# Altium schematic sheet usb_uart.SchDoc: uSDR schematic
size Letter; Author: Ye-sheng Kuo; CompanyName: Univ. of Michigan; Revision: 2.0; SheetNumber: 8; SheetTotal: 16
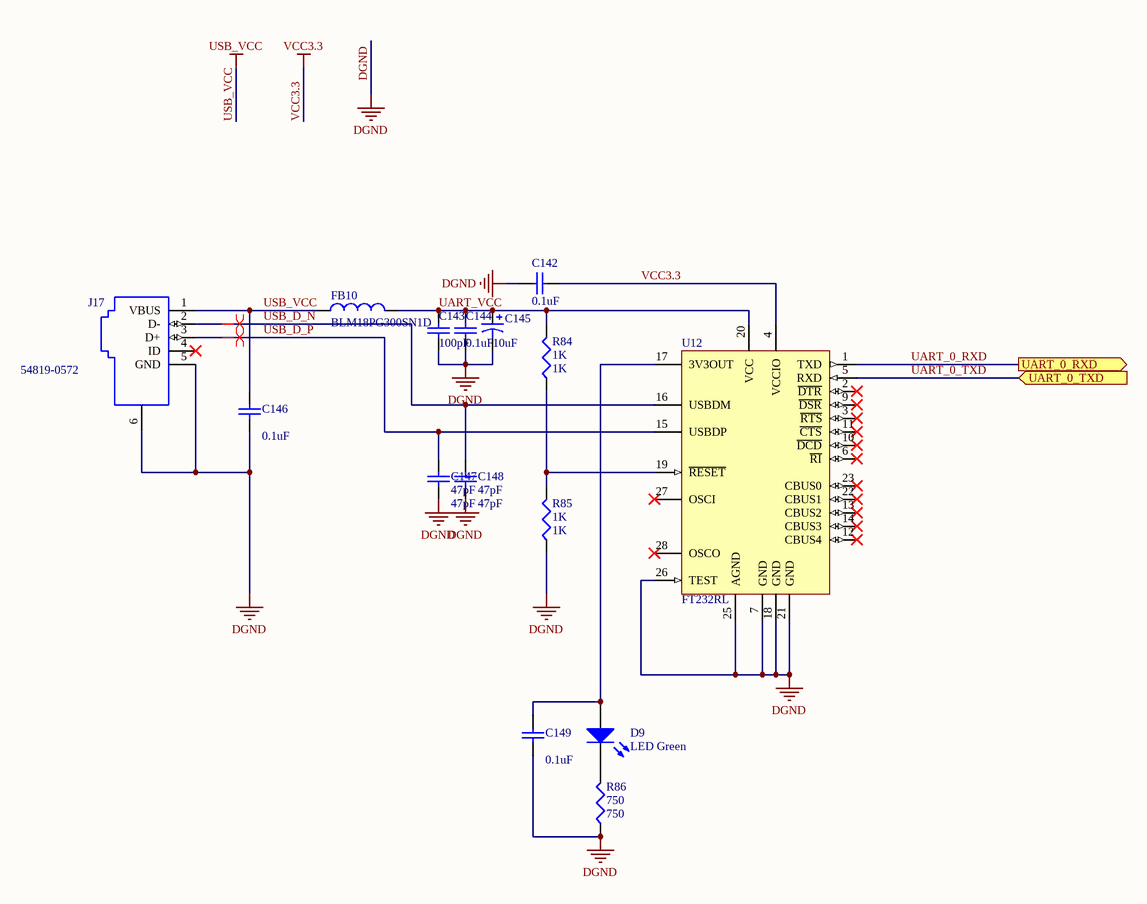
[diagram p0: usb_uart.SchDoc]

## Parts
C142  0.1uF  [0402]
C143  100pF  [0402]
C144  0.1uF  [0402]
C145  10uF  [C0805]
C146  0.1uF  [0402]
C147  47pF  [0402]
C148  47pF  [0402]
C149  0.1uF  [0402]
D9  LED Green  [1608[0603]]
FB10  BLM18PG300SN1D  [1608[0603]]
J17  54819-0572  [Mini USB]
R84  1K  [0402]
R85  1K  [0402]
R86  750  [0402]
U12  FT232RL  [SSOP65P780X200-28N]

## Ports
UART_0_RXD (out), UART_0_TXD (in)

## Nets
DGND: C142.1 C143.1 C144.1 C145.2 C146.1 C147.1 C148.1 C149.1 J17.5(GND) J17.6(SHIELD) R85.1 R86.1 U12.7(GND) U12.18(GND) U12.21(GND) U12.25(AGND) U12.26(TEST)
USB_VCC: C146.2 FB10.1 J17.1(VBUS)
VCC3.3: C142.2 U12.4(VCCIO)
UART_0_RXD: U12.1(TXD) ; port UART_0_RXD
UART_0_TXD: U12.5(RXD) ; port UART_0_TXD
UART_VCC: C143.2 C144.2 C145.1 FB10.2 R84.2 U12.20(VCC)
USB_D_N: C148.2 J17.2(D-) U12.16(USBDM)
USB_D_P: C147.2 J17.3(D+) U12.15(USBDP)
NetC149_2: C149.2 D9.1(A) U12.17(3V3OUT)
NetD9_2: D9.2(K) R86.2
NetR84_1: R84.1 R85.2 U12.19(~{RESET})

Not connected (* = marked no-connect by the designer): J17 4(ID)*; U12 2(~{DTR})* 3(~{RTS})* 6(~{RI})* 8(NC) 9(~{DSR})* 10(~{DCD})* 11(~{CTS})* 12(CBUS4)* 13(CBUS2)* 14(CBUS3)* 22(CBUS1)* 23(CBUS0)* 24(NC) 27(OSCI)* 28(OSCO)*

## Layout directives
differential pair: USB_D_N, USB_D_P

## Notes on the sheet
- Title
- Date:
- Author:
- Revision:
- Sheet
- of
- University of Michigan
- File:

## Library data of the parts
C142-C144 C146-C149 = Cap Semi: Capacitor (Semiconductor SIM Model); Published: 8-Jun-2000; LatestRevisionDate: 29-May-2009; LatestRevisionNote: IPC-7351 Footprint Added.; PackageReference: C1206; Publisher: Altium Limited; PackageDescription: Chip Capacitor
  C142 C144 C146 C149: Value: 0.1uF
  C143: Value: 100pF
  C147 C148: Value: 47pF
C145 = Cap Pol3: Polarized Capacitor (Surface Mount); Published: 8-Jun-2000; LatestRevisionDate: 29-May-2009; LatestRevisionNote: IPC-7351 Footprint Added.; PackageReference: C0805; Publisher: Altium Limited; PackageDescription: Chip Capacitor; Value: 10uF
D9 = LED2: Typical RED, GREEN, YELLOW, AMBER GaAs LED; Published: 8-Jun-2000; LatestRevisionDate: 17-Jul-2002; LatestRevisionNote: Re-released for DXP Platform.; PackageVersion: Feb-2002; PackageReference: 3.2X1.6X1.1; Publisher: Altium Limited; PackageDescription: SM LED; 2 Flat Leads
FB10 = Ferrite Bead: FERRITE CHIP 30 OHM 1000MA 0603; Supplier 1: Digi-Key; Supplier Part Number 1: 490-1035-2-ND
J17 = Mini USB: CONN RECEPT MINIUSB R/A 5POS SMD; Supplier 1: Digi-Key; Supplier Part Number 1: WM17116CT-ND
R84-R86 = Res3: Resistor; Published: 8-Jun-2000; LatestRevisionDate: 29-May-2009; LatestRevisionNote: IPC-7351 Footprint Added.; PackageReference: J1-0603; Publisher: Altium Limited; PackageDescription: Chip Resistor
  R84 R85: Value: 1K
  R86: Value: 750
U12 = FT232RL: USB to UART interface in SSOP-28 package; Manufacturer: Future Technology Devices International Ltd. (FTDI); Note: *; DigiKeyPartNo: 768-1007-1-ND; ManufacturerPartNo: FT232RL; ComponentLink1Description: Manufacturer Link; ComponentLink1URL: http://www.ftdichip.com/Products/FT232R.htm; ComponentLink2Description: Datasheet; ComponentLink2URL: http://www.ftdichip.com/Documents/DataSheets/DS_FT232R_V204.pdf; DatasheetVersion: ver 2.04, Jun-2009; LatestRevisionNote: IPC-7351 Footprint Added.; PackageReference: SSOP65P780X200-28N; PackageDescription: SSOP, 28-Leads, Body 10.3x5.6mm (max), Pitch 0.65mm, IPC Medium Density; PackageVersion: Jan-2011; Published: 27-Oct-2009; Publisher: FTDI Ltd.; Supplier 1: Digi-Key; Supplier 2: Newark; Supplier 3: Farnell; Supplier Part Number 1: 768-1007-2-ND; Supplier Part Number 2: 91K9918; Supplier Part Number 3: 1146032